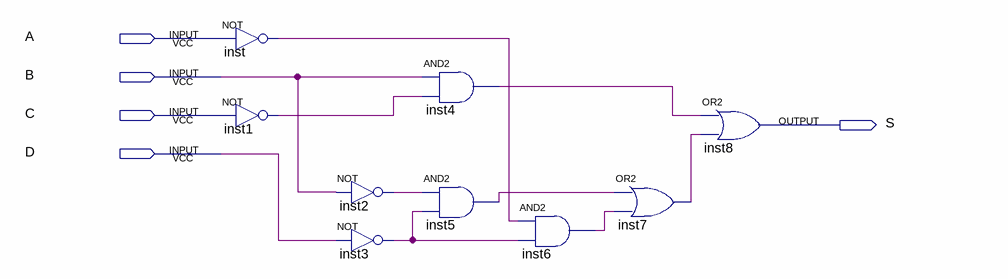
[diagram p0: schematic sheet]
// Quartus schematic misc_7.bdf as structural Verilog: 9 symbols, 5 pins
module misc_7 (
  input  A,
  input  B,
  input  C,
  input  D,
  output S
);

  wire inst1_out, inst2_out, inst3_out, inst4_out, inst5_out, inst6_out, inst7_out, inst_out;

  not inst (inst_out, A);
  not inst1 (inst1_out, C);
  not inst2 (inst2_out, B);
  not inst3 (inst3_out, D);
  and inst4 (inst4_out, B, inst1_out);
  and inst5 (inst5_out, inst2_out, inst3_out);
  and inst6 (inst6_out, inst_out, inst3_out);
  or inst7 (inst7_out, inst5_out, inst6_out);
  or inst8 (S, inst4_out, inst7_out);
endmodule
